# Altium schematic sheet POC_Power_Management.SchDoc
size A
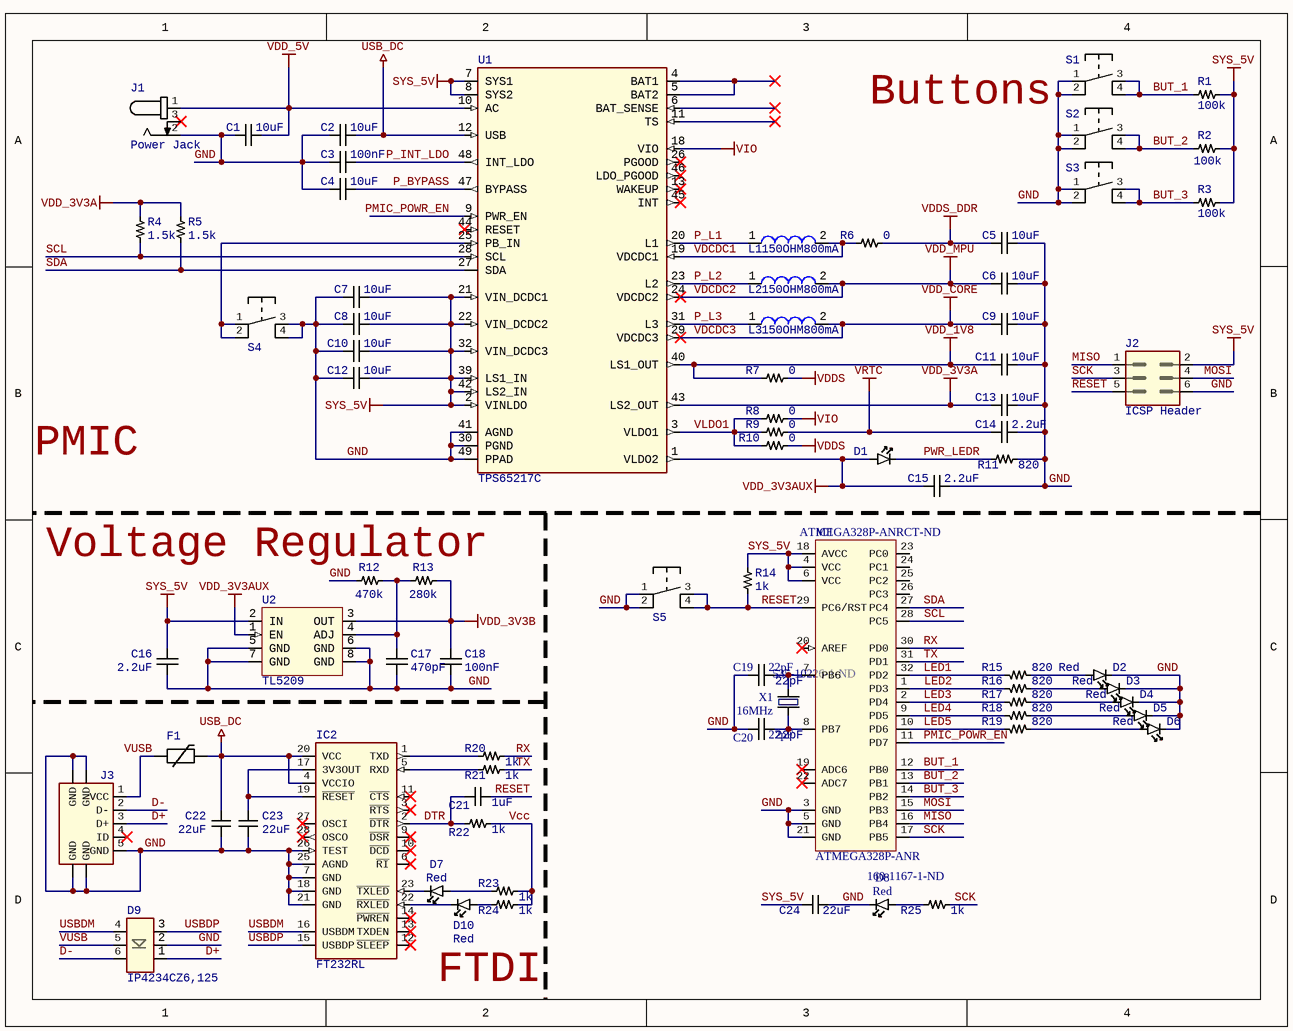
[diagram p0: POC_Power_Management.SchDoc]

## Parts
C1  Capacitance: 10uF  [CAP0805]  (hidden comment: C2012X6S1A106K085AC)
C2  Capacitance: 10uF  [CAP0805]  (hidden comment: C2012X6S1A106K085AC)
C3  Capacitance: 100nF  [CAP0402]  (hidden comment: C0402C104K4RACTU)
C4  Capacitance: 10uF  [CAP0805]  (hidden comment: C2012X6S1A106K085AC)
C5  Capacitance: 10uF  [CAP0805]  (hidden comment: C2012X6S1A106K085AC)
C6  Capacitance: 10uF  [CAP0805]  (hidden comment: C2012X6S1A106K085AC)
C7  Capacitance: 10uF  [CAP0805]  (hidden comment: C2012X6S1A106K085AC)
C8  Capacitance: 10uF  [CAP0805]  (hidden comment: C2012X6S1A106K085AC)
C9  Capacitance: 10uF  [CAP0805]  (hidden comment: C2012X6S1A106K085AC)
C10  Capacitance: 10uF  [CAP0805]  (hidden comment: C2012X6S1A106K085AC)
C11  Capacitance: 10uF  [CAP0805]  (hidden comment: C2012X6S1A106K085AC)
C12  Capacitance: 10uF  [CAP0805]  (hidden comment: C2012X6S1A106K085AC)
C13  Capacitance: 10uF  [CAP0805]  (hidden comment: C2012X6S1A106K085AC)
C14  Capacitance: 2.2uF  [CAP0402]  (hidden comment: C1005X5R0J225K050BC)
C15  Capacitance: 2.2uF  [CAP0402]  (hidden comment: C1005X5R0J225K050BC)
C16  Capacitance: 2.2uF  [CAP0402]  (hidden comment: C1005X5R0J225K050BC)
C17  Capacitance: 470pF  [CAP0402]  (hidden comment: GRM155R71H471KA01D)
C18  Capacitance: 100nF  [CAP0402]  (hidden comment: C0402C104K4RACTU)
C19  22pF  [CAP0402]
C20  22pF  [CAP0402]
C21  Capacitance: 1uF  [CAP0402]  (hidden comment: CC0402KRX5R5BB105)
C22  Capacitance: 22uF  [CAP0805]  (hidden comment: CL21A226MQQNNNE)
C23  Capacitance: 22uF  [CAP0805]  (hidden comment: CL21A226MQQNNNE)
C24  Capacitance: 22uF  [CAP0805]  (hidden comment: CL21A226MQQNNNE)
D1  Red  [LED]  (value not drawn)
D2  Red  [LED]
D3  Red  [LED]
D4  Red  [LED]
D5  Red  [LED]
D6  Red  [LED]
D7  Red  [LED]
D8  Red  Supplier Part Number 1: 160-1167-1-ND  [LED]
D9  IP4234CZ6,125  [TSOP-6]
D10  Red  [LED]
F1  MF-MSMF050-2  [FUSE]  (value not drawn)
IC1  ATMEGA328P-ANR  Supplier Part Number 1: ATMEGA328P-ANRCT-ND  [TQFP-32]
IC2  FT232RL  [SSOP-28]
J1  Power Jack  [Power_Jack]
J2  ICSP Header  [ICSP]
J3  XM7D-0512  [XM7D-0512]  (value not drawn)
L1  150OHM800mA  [FB0805]
L2  150OHM800mA  [FB0805]
L3  150OHM800mA  [FB0805]
R1  Resistance: 100k  [RES0402]  (hidden comment: RC0402FR-07100KL)
R2  Resistance: 100k  [RES0402]  (hidden comment: RC0402FR-07100KL)
R3  Resistance: 100k  [RES0402]  (hidden comment: RC0402FR-07100KL)
R4  Resistance: 1.5k  [RES0402]  (hidden comment: RC0402FR-071K5L)
R5  Resistance: 1.5k  [RES0402]  (hidden comment: RC0402FR-071K5L)
R6  Resistance: 0  [RES0402]  (hidden comment: RC0402JR-070RL)
R7  Resistance: 0  [RES0402]  (hidden comment: RC0402JR-070RL)
R8  Resistance: 0  [RES0402]  (hidden comment: RC0402JR-070RL)
R9  Resistance: 0  [RES0402]  (hidden comment: RC0402JR-070RL)
R10  Resistance: 0  [RES0402]  (hidden comment: RC0402JR-070RL)
R11  Resistance: 820  [RES0402]  (hidden comment: RC0402FR-07820RL)
R12  Resistance: 470k  [RES0402]  (hidden comment: RC0402FR-07470KL)
R13  Resistance: 280k  [RES0402]  (hidden comment: RC0402FR-07280KL)
R14  Resistance: 1k  [RES0402]  (hidden comment: RC0402FR-071KL)
R15  Resistance: 820  [RES0402]  (hidden comment: RC0402FR-07820RL)
R16  Resistance: 820  [RES0402]  (hidden comment: RC0402FR-07820RL)
R17  Resistance: 820  [RES0402]  (hidden comment: RC0402FR-07820RL)
R18  Resistance: 820  [RES0402]  (hidden comment: RC0402FR-07820RL)
R19  Resistance: 820  [RES0402]  (hidden comment: RC0402FR-07820RL)
R20  Resistance: 1k  [RES0402]  (hidden comment: RC0402FR-071KL)
R21  Resistance: 1k  [RES0402]  (hidden comment: RC0402FR-071KL)
R22  Resistance: 1k  [RES0402]  (hidden comment: RC0402FR-071KL)
R23  Resistance: 1k  [RES0402]  (hidden comment: RC0402FR-071KL)
R24  Resistance: 1k  [RES0402]  (hidden comment: RC0402FR-071KL)
R25  Resistance: 1k  [RES0402]  (hidden comment: RC0402FR-071KL)
S1  TL3305AF160QG  [Switch]  (value not drawn)
S2  TL3305AF160QG  [Switch]  (value not drawn)
S3  TL3305AF160QG  [Switch]  (value not drawn)
S4  TL3305AF160QG  [Switch]  (value not drawn)
S5  TL3305AF160QG  [Switch]  (value not drawn)
U1  TPS65217C  [PVQFN-48]
U2  TL5209  [SOIC-8]
X1  16MHz  Supplier Part Number 1: 535-10226-1-ND  [Crystal]

## Nets
SYS_5V: C7.1 C8.1 C10.1 C12.1 C16.1 C24.1 IC1.4(VCC) IC1.6(VCC) IC1.18(AVCC) J2.2 R1.1 R2.1 R3.1 R14.2 U1.2(VINLDO) U1.7(SYS1) U1.8(SYS2) U1.21(VIN_DCDC1) U1.22(VIN_DCDC2) U1.32(VIN_DCDC3) U1.39(LS1_IN) U1.42(LS2_IN) U2.2(IN)
USB_DC: C2.1 C22.1 F1.2 IC2.4(VCCIO) IC2.20(VCC) U1.12(USB)
VDCDC2: C6.2 L2.2 U1.24(VDCDC2)  [also labelled VDD_MPU]
VDCDC3: C9.2 L3.2 U1.29(VDCDC3)  [also labelled VDD_CORE]
VDD_1V8: C11.2 R7.1 U1.40(LS1_OUT)
VDD_3V3A: C13.2 R4.2 R5.2 U1.43(LS2_OUT)
VDD_3V3AUX: C15.2 D1.2 U1.1(VLDO2) U2.1(EN)
VDD_3V3B: C18.1 R13.2 U2.3(OUT)
VDD_5V: C1.1 J1.1 U1.10(AC)
VDDS: R7.2 R10.2
VDDS_DDR: C5.2 R6.2
VIO: R8.2 U1.18(VIO)
VRTC: C14.2 R9.2
BUT_1: IC1.12(PB0) R1.2 S1.3 S1.4
BUT_2: IC1.13(PB1) R2.2 S2.3 S2.4
BUT_3: IC1.14(PB2) R3.2 S3.3 S3.4
D+: D9.1 J3.3(D+)
D-: D9.6 J3.2(D-)
DTR: C21.1 IC2.2(~{DTR}) R22.1
GND: C1.2 C2.2 C3.2 C4.2 C5.1 C6.1 C7.2 C8.2 C9.1 C10.2 C11.1 C12.2 C13.1 C14.1 C15.1 C16.2 C17.2 C18.2 C19.2 C20.2 C22.2 C23.2 C24.2 D2.1 D3.1 D4.1 D5.1 D6.1 D8.1 D9.2 IC1.3(GND) IC1.5(GND) IC1.21(GND) IC2.7(GND) IC2.18(GND) IC2.21(GND) IC2.25(AGND) IC2.26(TEST) J1.2 J2.6 J3.5(GND) J3.SH1(GND) J3.SH2(GND) J3.SH3(GND) J3.SH4(GND) R11.2 R12.1 S1.1 S1.2 S2.1 S2.2 S3.1 S3.2 S4.3 S4.4 S5.1 S5.2 U1.30(PGND) U1.41(AGND) U1.49(PPAD) U2.5(GND) U2.6(GND) U2.7(GND) U2.8(GND)
LED1: IC1.32(PD2) R15.2
LED2: IC1.1(PD3) R16.2
LED3: IC1.2(PD4) R17.2
LED4: IC1.9(PD5) R18.2
LED5: IC1.10(PD6) R19.2
MISO: IC1.16(PB4) J2.1
MOSI: IC1.15(PB3) J2.4
P_BYPASS: C4.1 U1.47(BYPASS)
P_INT_LDO: C3.1 U1.48(INT_LDO)
P_L1: L1.1 U1.20(L1)
P_L2: L2.1 U1.23(L2)
P_L3: L3.1 U1.31(L3)
PMIC_POWR_EN: IC1.11(PD7) U1.9(PWR_EN)
PWR_LEDR: D1.1 R11.1
RESET: C21.2 IC1.29(PC6/RST) J2.5 R14.1 S5.3 S5.4
RX: IC1.30(PD0) R20.2
SCK: IC1.17(PB5) J2.3 R25.2
SCL: IC1.28(PC5) R4.1 U1.28(SCL)
SDA: IC1.27(PC4) R5.1 U1.27(SDA)
TX: IC1.31(PD1) R21.2
USBDM: D9.4 IC2.16(USBDM)
USBDP: D9.3 IC2.15(USBDP)
Vcc: R22.2 R23.2 R24.2
VDCDC1: L1.2 R6.1 U1.19(VDCDC1)
VLDO1: R8.1 R9.1 R10.1 U1.3(VLDO1)
VUSB: D9.5 F1.1 J3.1(VCC)
NetC17_1: C17.1 R12.2 R13.1 U2.4(ADJ)
NetC19_1: C19.1 IC1.7(PB6) X1.2
NetC20_1: C20.1 IC1.8(PB7) X1.1
NetC23_1: C23.1 IC2.17(3V3OUT) IC2.19(~{RESET})
NetD2_2: D2.2 R15.1
NetD3_2: D3.2 R16.1
NetD4_2: D4.2 R17.1
NetD5_2: D5.2 R18.1
NetD6_2: D6.2 R19.1
NetD7_1: D7.1 IC2.23(~{TXLED})
NetD7_2: D7.2 R23.1
NetD8_2: D8.2 R25.1
NetD10_1: D10.1 IC2.22(~{RXLED})
NetD10_2: D10.2 R24.1
NetIC2_1: IC2.1(TXD) R20.1
NetIC2_5: IC2.5(RXD) R21.1
NetS4_1: S4.1 S4.2 U1.25(PB_IN)
NetU1_4: U1.4(BAT1) U1.5(BAT2)

Not connected (* = marked no-connect by the designer): IC1 19(ADC6)* 20(AREF)* 22(ADC7)* 23(PC0) 24(PC1) 25(PC2) 26(PC3); IC2 3(~{RTS})* 6(~{RI})* 9(~{DSR})* 10(~{DCD})* 11(~{CTS})* 12(~{SLEEP})* 13(TXDEN)* 14(~{PWREN})* 27(OSCI)* 28(OSCO)*; J1 3*; J3 4(ID)*; U1 6(BAT_SENSE)* 11(TS)* 13(WAKEUP)* 26(PGOOD)* 44(RESET)* 45(INT)* 46(LDO_PGOOD)*

## Notes on the sheet
- Buttons
- PMIC
- Voltage Regulator
- FTDI

## Library data of the parts
C1 C2 C4-C13 = CAP_10uF: MLCC 10uF 0805 SMD; Manufacturer: TDK; Dielectric Material: Ceramic; Tolerance: 10%; Voltage Rating: 10V; Dielectric: X6S; Supplier 1: Digi-Key; Manufacturer Part Number: C2012X6S1A106K085AC; Stock 1: 46852; Pricing 1: 1=0.30000, 10=0.20500, 100=0.11610, 500=0.08198, 1000=0.07173 (USD); RoHS: Yes; Mount: Surface Mount; Case/Package: 0805; Weight: 0.000194oz; Case Code (Metric): 2012; Case Code (Imperial): 0805; Min Operating Temperature: -55°C; Max Operating Temperature: 105°C; Packaging: Tape and Reel; Termination: SMD/SMT; Package Quantity: 4000; Voltage Rating (DC): 10V; Composition: Ceramic; Length: 2mm; Height: 1.25mm; Depth: 1.25mm; Width: 0.049inch; Thickness: 0.037inch; REACH SVHC: No SVHC; Lead Free: Lead Free; ComponentLink3URL: https://datasheet.ciiva.com/6290/tdkmlcccaprange-6290501.pdf?src-supplier=Digi-Key; ComponentLink3Description: Datasheet; Supplier Part Number 1: 445-7613-1-ND
C3 C18 = CAP_100nF: MLCC 100nF 0402 SMD; Manufacturer: KEMET; Tolerance: 10%; Voltage Rating (DC): 16V; Dielectric: X7R; Dissipation Factor: 3.5%; Supplier 1: Digi-Key; Manufacturer Part Number: C0402C104K4RACTU; Stock 1: 6512243; Pricing 1: 1=0.10000, 10=0.04200, 100=0.01860, 500=0.01328, 1000=0.01044, 2500=0.00949, 5000=0.00873 (USD); RoHS: Yes; Mount: Surface Mount; Case/Package: 0402; Case Code (Imperial): 0402; Case Code (Metric): 1005; Contact Plating: Tin,Matte; Min Operating Temperature: -55°C; Max Operating Temperature: 125°C; Packaging: Tape and Reel; Package Quantity: 10000; Voltage Rating: 16V; Termination: SMD/SMT; Length: 1mm; Height: 0.5mm; Width: 0.5mm; Depth: 0.5mm; Radiation Hardening: No; ComponentLink2URL: https://datasheet.ciiva.com/18192/getdatasheetpartid-385384-18192412.pdf?src-supplier=Verical; ComponentLink2Description: Datasheet; Supplier Part Number 1: 399-3521-1-ND
C14-C16 = CAP_2.2uF: MLCC 2.2uF 0402 SMD; Manufacturer: TDK; Dielectric Material: Ceramic; Tolerance: 10%; Dielectric: X5R; Voltage Rating: 6.3V; Supplier 1: Digi-Key; Manufacturer Part Number: C1005X5R0J225K050BC; RoHS: Yes; Mount: Surface Mount; Case/Package: 0402; Number of Pins: 2; Weight: 2.3E-05oz; Case Code (Metric): 1005; Case Code (Imperial): 0402; Min Operating Temperature: -55°C; Max Operating Temperature: 85°C; Packaging: Tape and Reel; Voltage Rating (DC): 6.3V; Termination: SMD/SMT; Package Quantity: 1; Composition: Ceramic; Voltage: 6.3V; Length: 1mm; Height: 0.5mm; Width: 0.02inch; Depth: 0.5mm; Thickness: 0.022inch; Radiation Hardening: No; Lead Free: Lead Free; REACH SVHC: No SVHC; ComponentLink7Description: Datasheet; ComponentLink7URL: https://product.tdk.com/info/en/catalog/datasheets/mlcc_commercial_general_en.pdf?ref_disty=digikey; Supplier Part Number 1: 445-6847-1-ND
C17 = CAP_470pF: MLCC 470pF 0402 SMD; Manufacturer: Murata; Material: Ceramic; Tolerance: 10%; Dielectric: X7R; Voltage Rating: 50V; Supplier 1: Digi-Key; Manufacturer Part Number: GRM155R71H471KA01D; Stock 1: 1824670; Pricing 1: 1=0.10000, 10=0.04900, 100=0.02200, 500=0.01572, 1000=0.01235, 2500=0.01122, 5000=0.01033 (USD); RoHS: Yes; Mount: Surface Mount; Case/Package: 0402; Number of Pins: 2; Case Code (Metric): 1005; Case Code (Imperial): 0402; Min Operating Temperature: -55°C; Max Operating Temperature: 125°C; Package Quantity: 1; Packaging: Tape and Reel; Voltage Rating (DC): 50V; Termination: SMD/SMT; Voltage: 50V; Length: 1mm; Height: 0.5mm; Width: 0.02inch; Thickness: 0.022inch; Depth: 0.5mm; Radiation Hardening: No; REACH SVHC: No SVHC; Lead Free: Lead Free; ComponentLink1URL: https://datasheet.ciiva.com/11786/0900766b80ef921d-11786912.pdf?src-supplier=RSComponents; ComponentLink1Description: https://datasheet.ciiva.com/11786/0900766b80ef921d-11786912.pdf?src-supplier=RSComponents; ComponentLink2URL: https://datasheet.ciiva.com/18101/getdatasheetpartid-37722-18101030.pdf?src-supplier=Verical; ComponentLink2Description: https://datasheet.ciiva.com/18101/getdatasheetpartid-37722-18101030.pdf?src-supplier=Verical; ComponentLink3URL: https://datasheet.ciiva.com/19476/1856505-19476137.pdf?src-supplier=Jameco; ComponentLink3Description: https://datasheet.ciiva.com/19476/1856505-19476137.pdf?src-supplier=Jameco; ComponentLink4URL: https://datasheet.ciiva.com/29199/454340-da-01-en-vs-kondensator-0402-29199656.pdf?src-supplier=Conrad; ComponentLink4Description: https://datasheet.ciiva.com/29199/454340-da-01-en-vs-kondensator-0402-29199656.pdf?src-supplier=Conrad; ComponentLink5URL: https://datasheet.ciiva.com/129/partnumbering-e-01-129843.pdf?src-supplier=Digi-Key; ComponentLink5Description: https://datasheet.ciiva.com/129/partnumbering-e-01-129843.pdf?src-supplier=Digi-Key; ComponentLink6URL: https://datasheet.ciiva.com/129/partnumbering-e-01-129844.pdf?src-supplier=Digi-Key; ComponentLink6Description: https://datasheet.ciiva.com/129/partnumbering-e-01-129844.pdf?src-supplier=Digi-Key; ComponentLink7URL: https://datasheet.ciiva.com/129/partnumbering-e-01-129845.pdf?src-supplier=Digi-Key; ComponentLink7Description: https://datasheet.ciiva.com/129/partnumbering-e-01-129845.pdf?src-supplier=Digi-Key; ComponentLink8URL: https://datasheet.ciiva.com/14116/grmseries-highdielectrictype-eng-14116837.pdf?src-supplier=Distrelec; ComponentLink8Description: https://datasheet.ciiva.com/14116/grmseries-highdielectrictype-eng-14116837.pdf?src-supplier=Distrelec; ComponentLink9URL: https://datasheet.ciiva.com/22698/608985-22698425.pdf?src-supplier=Element14; ComponentLink9Description: https://datasheet.ciiva.com/22698/608985-22698425.pdf?src-supplier=Element14; ComponentLink10URL: https://datasheet.ciiva.com/16199/product-16199180.pdf?src-supplier=Future+Electronics; ComponentLink10Description: https://datasheet.ciiva.com/16199/product-16199180.pdf?src-supplier=Future+Electronics; ComponentLink11URL: https://datasheet.ciiva.com/7937/608985-7937630.pdf?src-supplier=Element14; ComponentLink11Description: https://datasheet.ciiva.com/7937/608985-7937630.pdf?src-supplier=Element14; Supplier Part Number 1: 490-1300-1-ND
C19 C20 = CAP_22pF: MLCC 22pF 0402 SMD; Manufacturer: Yageo; Manufacturer Part Number: CC0402JRNPO9BN220; Dielectric Material: Ceramic; Tolerance: 5%; Dielectric: C0G; Voltage Rating (DC): 50V; Temperature Coefficient: 30ppm/°C; Insulation Resistance: 100GR; Supplier 1: Digi-Key; Stock 1: 3577721; Pricing 1: 1=0.10000, 10=0.02200, 100=0.00970, 500=0.00694, 1000=0.00545, 2500=0.00495, 5000=0.00455 (USD); RoHS: Yes; Mount: Surface Mount; Case/Package: 0402; Number of Pins: 2; Case Code (Metric): 1005; Case Code (Imperial): 0402; Min Operating Temperature: -55°C; Max Operating Temperature: 125°C; Voltage: 50V; Voltage Rating: 50V; Packaging: Tape and Reel; Package Quantity: 1; Termination: SMD/SMT; Composition: Ceramic; Length: 1mm; Height: 0.5mm; Depth: 0.5mm; Width: 0.02inch; Thickness: 0.022inch; Radiation Hardening: No; REACH SVHC: No SVHC; Lead Free: Lead Free; ComponentLink1URL: https://datasheet.ciiva.com/143/mlccorderingcode-143986.pdf?src-supplier=Digi-Key; ComponentLink1Description: https://datasheet.ciiva.com/143/mlccorderingcode-143986.pdf?src-supplier=Digi-Key; ComponentLink2URL: https://datasheet.ciiva.com/143/mlccorderingcode-143987.pdf?src-supplier=Digi-Key; ComponentLink2Description: https://datasheet.ciiva.com/143/mlccorderingcode-143987.pdf?src-supplier=Digi-Key; ComponentLink3URL: https://datasheet.ciiva.com/143/mlccorderingcode-143988.pdf?src-supplier=Digi-Key; ComponentLink3Description: https://datasheet.ciiva.com/143/mlccorderingcode-143988.pdf?src-supplier=Digi-Key; ComponentLink4URL: https://datasheet.ciiva.com/5789/1443161-5789509.pdf?src-supplier=Farnell; ComponentLink4Description: https://datasheet.ciiva.com/5789/1443161-5789509.pdf?src-supplier=Farnell; ComponentLink5URL: https://datasheet.ciiva.com/8033/1443161-8033605.pdf?src-supplier=Element14; ComponentLink5Description: https://datasheet.ciiva.com/8033/1443161-8033605.pdf?src-supplier=Element14; ComponentLink6URL: https://datasheet.ciiva.com/16625/upy-gp-np0-16v-to-50v-8-16625509.pdf?src-supplier=Avnet+Europe; ComponentLink6Description: https://datasheet.ciiva.com/16625/upy-gp-np0-16v-to-50v-8-16625509.pdf?src-supplier=Avnet+Europe; ComponentLink7URL: https://datasheet.ciiva.com/8033/1443161-8033606.pdf?src-supplier=Element14; ComponentLink7Description: https://datasheet.ciiva.com/8033/1443161-8033606.pdf?src-supplier=Element14; ComponentLink8URL: https://datasheet.ciiva.com/7656/1132289-7656615.pdf?src-supplier=Element14; ComponentLink8Description: https://datasheet.ciiva.com/7656/1132289-7656615.pdf?src-supplier=Element14; ComponentLink9URL: https://datasheet.ciiva.com/8033/1443161-8033607.pdf?src-supplier=Element14; ComponentLink9Description: https://datasheet.ciiva.com/8033/1443161-8033607.pdf?src-supplier=Element14; ComponentLink10URL: https://datasheet.ciiva.com/5425/upy-gp-np0-16v-to-50v-8-5425483.pdf?src-supplier=Mouser; ComponentLink10Description: https://datasheet.ciiva.com/5425/upy-gp-np0-16v-to-50v-8-5425483.pdf?src-supplier=Mouser; ComponentLink11URL: https://datasheet.ciiva.com/15189/getdatasheetpartid-370074-15189117.pdf?src-supplier=Verical; ComponentLink11Description: https://datasheet.ciiva.com/15189/getdatasheetpartid-370074-15189117.pdf?src-supplier=Verical; Supplier Part Number 1: 311-1018-1-ND; Capacitance: 22pF
C21 = CAP_1uF: MLCC 1uF 0402 SMD; Manufacturer: Yageo; Value: CAP CER 1UF 16V X7R 1206; Dielectric Material: Ceramic; Tolerance: 10%; Dielectric: X5R; Voltage Rating: 6.3V; Digikey Link: https://www.digikey.com/product-detail/en/C1206C105M4RACTU/399-8150-1-ND/3471873/?itemSeq=304982366; Digikey Part: 399-8150-1-ND; Supplier 1: Digi-Key; Manufacturer Part Number: CC0402KRX5R5BB105; Stock 1: 41021902; Pricing 1: 1=0.10000, 10=0.04700, 100=0.02100, 500=0.01502, 1000=0.01180, 2500=0.01072, 5000=0.00987 (USD); RoHS: Yes; Mount: Surface Mount; Case/Package: 0402; Number of Pins: 2; Case Code (Metric): 1005; Case Code (Imperial): 0402; Min Operating Temperature: -55°C; Max Operating Temperature: 85°C; Voltage Rating (DC): 6.3V; Package Quantity: 1; Packaging: Tape and Reel; Termination: SMD/SMT; Composition: Ceramic; Length: 1mm; Height: 0.5mm; Width: 0.02inch; Thickness: 0.022inch; Depth: 0.5mm; Radiation Hardening: No; REACH SVHC: No SVHC; Lead Free: Lead Free; Halogen Free: Halogen Free; ComponentLink1URL: https://datasheet.ciiva.com/5789/70765-5789520.pdf?src-supplier=Farnell; ComponentLink1Description: https://datasheet.ciiva.com/5789/70765-5789520.pdf?src-supplier=Farnell; ComponentLink2URL: https://datasheet.ciiva.com/176/mlccorderingcode-176609.pdf?src-supplier=Digi-Key; ComponentLink2Description: https://datasheet.ciiva.com/176/mlccorderingcode-176609.pdf?src-supplier=Digi-Key; ComponentLink3URL: https://datasheet.ciiva.com/16624/upy-gphc-x5r-4v-to-50v-12-16624731.pdf?src-supplier=Avnet+Europe; ComponentLink3Description: https://datasheet.ciiva.com/16624/upy-gphc-x5r-4v-to-50v-12-16624731.pdf?src-supplier=Avnet+Europe; ComponentLink4URL: https://datasheet.ciiva.com/8033/1525783-8033644.pdf?src-supplier=Element14; ComponentLink4Description: https://datasheet.ciiva.com/8033/1525783-8033644.pdf?src-supplier=Element14; ComponentLink5URL: https://datasheet.ciiva.com/176/mlccorderingcode-176610.pdf?src-supplier=Digi-Key; ComponentLink5Description: https://datasheet.ciiva.com/176/mlccorderingcode-176610.pdf?src-supplier=Digi-Key; ComponentLink6URL: https://datasheet.ciiva.com/176/mlccorderingcode-176611.pdf?src-supplier=Digi-Key; ComponentLink6Description: https://datasheet.ciiva.com/176/mlccorderingcode-176611.pdf?src-supplier=Digi-Key; ComponentLink7URL: https://datasheet.ciiva.com/8033/1525783-8033643.pdf?src-supplier=Element14; ComponentLink7Description: https://datasheet.ciiva.com/8033/1525783-8033643.pdf?src-supplier=Element14; ComponentLink8URL: https://datasheet.ciiva.com/28450/1359354-28450285.pdf?src-supplier=Element14; ComponentLink8Description: https://datasheet.ciiva.com/28450/1359354-28450285.pdf?src-supplier=Element14; ComponentLink9URL: https://datasheet.ciiva.com/8033/70765-8033646.pdf?src-supplier=Element14; ComponentLink9Description: https://datasheet.ciiva.com/8033/70765-8033646.pdf?src-supplier=Element14; ComponentLink10URL: https://datasheet.ciiva.com/11464/upy-gphc-x5r-4v-to-50v-12-11464863.pdf?src-supplier=Avnet; ComponentLink10Description: https://datasheet.ciiva.com/11464/upy-gphc-x5r-4v-to-50v-12-11464863.pdf?src-supplier=Avnet; Supplier Part Number 1: 311-1438-1-ND
C22-C24 = CAP_22uF: MLCC 22uF 0805 SMD; Manufacturer: Samsung; Value: CAP CER 22UF 16V X5R 1206; Tolerance: 20%; Dielectric: X5R; Voltage Rating (DC): 6.3V; Digikey Link: https://www.digikey.com/product-detail/en/CL31A226MOCLNNC/1276-2728-1-ND/3890814/?itemSeq=304982363; Digikey Part: 1276-2728-1-ND; Supplier 1: Digi-Key; Manufacturer Part Number: CL21A226MQQNNNE; Stock 1: 4275367; Pricing 1: 1=0.18000, 10=0.12100, 100=0.06140, 500=0.04204, 1000=0.03719 (USD); RoHS: Yes; Mount: Surface Mount; Case/Package: 0805; Case Code (Metric): 2012; Case Code (Imperial): 0805; Contact Plating: Tin; Min Operating Temperature: -55°C; Max Operating Temperature: 85°C; Package Quantity: 2000; Packaging: Tape and Reel; Voltage Rating: 6.3V; Length: 2mm; Height: 1.25mm; Width: 0.049inch; Thickness: 0.055inch; Depth: 1.25mm; Radiation Hardening: No; Lead Free: Lead Free; ComponentLink1URL: https://datasheet.ciiva.com/25796/cl21a226mqqnnne-25796195.pdf?src-supplier=Digi-Key; ComponentLink1Description: https://datasheet.ciiva.com/25796/cl21a226mqqnnne-25796195.pdf?src-supplier=Digi-Key; ComponentLink2URL: https://datasheet.ciiva.com/26838/getdatasheetpartid-357607-26838611.pdf?src-supplier=Verical; ComponentLink2Description: https://datasheet.ciiva.com/26838/getdatasheetpartid-357607-26838611.pdf?src-supplier=Verical; ComponentLink3URL: https://datasheet.ciiva.com/16361/cl21a226mqqnnne-16361189.pdf?src-supplier=Future+Electronics; ComponentLink3Description: https://datasheet.ciiva.com/16361/cl21a226mqqnnne-16361189.pdf?src-supplier=Future+Electronics; ComponentLink4URL: https://datasheet.ciiva.com/26787/cl21a226mqqnnne-26787006.pdf?src-supplier=IIIC; ComponentLink4Description: https://datasheet.ciiva.com/26787/cl21a226mqqnnne-26787006.pdf?src-supplier=IIIC; Supplier Part Number 1: 1276-1100-1-ND
D1-D8 D10 = LED_Red: Red 638nm LED Indication - Discrete 1.8V 1206 (3216 Metric); Value: LED RED CLEAR 1206 SMD; Digikey Link: https://www.digikey.com/product-detail/en/LTST-C150CKT/160-1167-1-ND/269239/?itemSeq=304982368; Digikey Part: 160-1167-1-ND; Supplier 1: Digi-Key
  D1-D7 D10: Supplier Part Number 1: 160-1167-1-ND
D9 = TVS_Diode: Clamp Ipp Tvs Diode Surface Mount 6-TSOP; Value: TVS DIODE 5.5V 6TSOP; Digikey Part: 1727-4717-1-ND; Digikey Link: https://www.digikey.com/product-detail/en/IP4234CZ6%2c125/1727-4717-1-ND/2531156/?itemSeq=304982369; Supplier 1: Digi-Key; Supplier Part Number 1: 1727-4717-1-ND
F1 = Fuse: Polymeric PTC Resettable Fuse 15V 500mA Ih Surface Mount 1812 (4532 Metric), Concave; Value: PTC RESET FUSE 15V 500MA 1812; Digikey Link: https://www.digikey.com/product-detail/en/MF-MSMF050-2/MF-MSMF050-2CT-ND/662842/?itemSeq=304982360; Digikey Part: MF-MSMF050-2CT-ND; Supplier 1: Digi-Key; Supplier Part Number 1: MF-MSMF050-2CT-ND
IC1 = ATMega328P: AVR AVR® ATmega Microcontroller IC 8-Bit 20MHz 32KB (16K x 16) FLASH 32-TQFP (7x7); Value: IC MCU 8BIT 32KB FLASH 32TQFP; Digikey Link: https://www.digikey.com/product-detail/en/ATMEGA328P-ANR/ATMEGA328P-ANRCT-ND/2774230/?itemSeq=304982365; Digikey Part: ATMEGA328P-ANRCT-ND; Supplier 1: Digi-Key
IC2 = IC_FT232RL: USB Bridge, USB to UART USB 2.0 UART Interface 28-SSOP; Value: IC USB FS SERIAL UART 28-SSOP; Digikey Part: 768-1007-1-ND; Digikey Link: https://www.digikey.com/product-detail/en/FT232RL-REEL/768-1007-1-ND/1836402/?itemSeq=304982359; Supplier 1: Digi-Key; Supplier Part Number 1: 768-1007-1-ND
J1 = Power Jack: Power Barrel Connector Jack 2.10mm ID (0.083"), 5.50mm OD (0.217") Through Hole, Right Angle; Value: CONN PWR JACK 2X5.5MM SOLDER; Digikey Link: https://www.digikey.com/product-detail/en/PJ-102A/CP-102A-ND/275425/?itemSeq=304982367; Digikey Part: CP-102A-ND; Supplier 1: Digi-Key; Supplier Part Number 1: CP-102A-ND
J2 = HDR_ICSP: 2x3 Header for Arduino ICSP; Supplier 1: Digi-Key; Supplier Part Number 1: S2012EC-03-ND
J3 = USB: USB - mini B USB 2.0 Receptacle Connector 5 Position Through Hole, Right Angle; Value: CONN RCPT USB2.0 MINI B 5P R/A; Digikey Link: https://www.digikey.com/product-detail/en/XM7D-0512/OR1205-ND/4695531/?itemSeq=304982356; Digikey Part: OR1205-ND; Supplier 1: Digi-Key; Supplier Part Number 1: OR1205-ND
L1-L3 = IND: FERRITE 800MA 150 OHM 0805 SMD; Manufacturer: Laird-Signal Integrity Products; Manufacturer Part Number: LI0805H151R-10; DC Resistance (DCR): 150 mOhm Max; Impedance @ Frequency: 150 Ohm @ 100MHz; Filter Type: Differential Mode - Single; Supplier 1: Digi-Key; Supplier Part Number 1: 240-2384-6-ND; RoHS: RoHS Compliant; Category: Filters; Stock 1: 10144; Pricing 1: 1=0.1, 10=0.07, 25=0.064, 50=0.0574, 100=0.0421, 250=0.03064, 500=0.02808, 1000=0.02424 (USD); Current Rating: 800mA; Package / Case: 0805 (2012 Metric); Size / Dimension: 0.079" L x 0.049" W (2.00mm x 1.25mm); Mounting Type: Surface Mount; Packaging: Digi-Reel®; ComponentLink1URL: http://www.lairdtech.com/WorkArea/linkit.aspx?LinkIdentifier=id&ItemID=4912; ComponentLink1Description: http://www.lairdtech.com/WorkArea/linkit.aspx?LinkIdentifier=id&ItemID=4912; Height (Max): 0.043" (1.10mm)
R1-R3 = RES_100k: Resistor 100kOhm 0402 SMD; Manufacturer: Yageo; Tolerance: 1%; Temperature Coefficient: 100ppm/°C; Power Rating: 63mW; Voltage Rating: 50V; Manufacturer Part Number: RC0402FR-07100KL; RoHS: Yes; Case/Package: 0402; Case Code (Metric): 1005; Case Code (Imperial): 0402; Min Operating Temperature: -55°C; Max Operating Temperature: 155°C; Composition: Thick Film; Packaging: Tape and Reel; Package Quantity: 1; Number of Terminations: 2; Termination: SMD/SMT; Military Standard: Not; Max Power Dissipation: 63mW; Working Voltage: 50V; Features: Moisture Resistant; Length: 0.039inch; Height: 0.016inch; Width: 0.02inch; Depth: 0.5mm; REACH SVHC: No SVHC; Lead Free: Lead Free; ComponentLink2Description: Datasheet; ComponentLink2URL: https://www.yageo.com/upload/media/product/productsearch/datasheet/rchip/PYu-RC_Group_51_RoHS_L_10.pdf; Supplier 1: Digi-Key; Supplier Part Number 1: 311-100KLRCT-ND
R4 R5 = RES_1.5k: Resistor 1.5kOhm 0402 SMD; Manufacturer: Yageo; Power Rating: 62.5mW; Tolerance: 1%; Voltage Rating: 50V; Temperature Coefficient: 100ppm/°C; Max Power Dissipation: 63mW; Manufacturer Part Number: RC0402FR-071K5L; RoHS: Yes; Case/Package: 0402; Case Code (Metric): 1005; Case Code (Imperial): 0402; Min Operating Temperature: -55°C; Max Operating Temperature: 155°C; Composition: Thick Film; Package Quantity: 1; Packaging: Tape and Reel; Number of Terminations: 2; Termination: SMD/SMT; Military Standard: Not; Features: Moisture Resistant; Length: 1mm; Height: 0.016inch; Width: 0.02inch; Depth: 0.5mm; REACH SVHC: No SVHC; Lead Free: Lead Free; Supplier 1: Digi-Key; Supplier Part Number 1: 311-1.50KLRCT-ND; ComponentLink1Description: Datasheet; ComponentLink1URL: https://www.yageo.com/upload/media/product/productsearch/datasheet/rchip/PYu-RC_Group_51_RoHS_L_10.pdf
R6-R10 = RES_0: Resistor 0Ohm 0402 SMD; Manufacturer: Yageo; Power Rating: 62.5mW; Tolerance: 5%; Voltage Rating: 50V; Temperature Coefficient: 200ppm/°C; Max Power Dissipation: 63mW; Supplier 1: Digi-Key; Manufacturer Part Number: RC0402JR-070RL; Stock 1: 68160806; Pricing 1: 1=0.10000, 10=0.01300, 25=0.00920, 50=0.00700, 100=0.00510, 250=0.00392, 500=0.00312, 1000=0.00230, 5000=0.00165 (USD); RoHS: Yes; Case/Package: 0402; Contact Plating: Tin,Matte; Case Code (Metric): 1005; Case Code (Imperial): 0402; Min Operating Temperature: -55°C; Max Operating Temperature: 155°C; Composition: Thick Film; Packaging: Tape and Reel; Termination: SMD/SMT; Package Quantity: 1; Number of Terminations: 2; Military Standard: Not; Features: Moisture Resistant; Length: 1mm; Height: 0.016inch; Width: 0.02inch; Depth: 0.5mm; Radiation Hardening: No; Lead Free: Lead Free; REACH SVHC: Unknown; Supplier Part Number 1: 311-0.0JRCT-ND; ComponentLink1Description: Digikey; ComponentLink1URL: https://www.digikey.com/product-detail/en/yageo/RC0402JR-070RL/311-0.0JRCT-ND/729353; ComponentLink2Description: Datasheet; ComponentLink2URL: https://www.yageo.com/upload/media/product/productsearch/datasheet/rchip/PYu-RC_Group_51_RoHS_L_10.pdf
R11 R15-R19 = RES_820: Resistor 820Ohm 0402 SMD; Manufacturer: Yageo; Voltage Rating: 50V; Tolerance: 1%; Power Rating: 63mW; Temperature Coefficient: 100ppm/°C; Supplier 1: Digi-Key; Manufacturer Part Number: RC0402FR-07820RL; Stock 1: 1640857; Pricing 1: 1=0.10000, 10=0.01600, 100=0.00640, 1000=0.00289, 2500=0.00251, 5000=0.00207 (USD); RoHS: Yes; Case/Package: 0402; Case Code (Imperial): 0402; Case Code (Metric): 1005; Min Operating Temperature: -55°C; Max Operating Temperature: 155°C; Packaging: Tape and Reel; Package Quantity: 1; Termination: SMD/SMT; Composition: Thick Film; Number of Terminations: 2; Military Standard: Not; Max Power Dissipation: 63mW; Features: Moisture Resistant; Length: 1mm; Height: 0.016inch; Width: 0.5mm; Depth: 0.5mm; REACH SVHC: Unknown; Lead Free: Lead Free; Supplier Part Number 1: 311-820LRCT-ND
R12 = RES_470k: Resistor 470kOhm 0402 SMD; Manufacturer: Yageo; Tolerance: 1%; Power Rating: 62.5mW; Voltage Rating: 50V; Temperature Coefficient: 100ppm/°C; Max Power Dissipation: 63mW; Supplier 1: Digi-Key; Manufacturer Part Number: RC0402FR-07470KL; Stock 1: 2249859; Pricing 1: 1=0.10000, 10=0.01600, 100=0.00640, 1000=0.00289, 2500=0.00251, 5000=0.00207 (USD); RoHS: Yes; Case/Package: 0402; Number of Pins: 2; Case Code (Imperial): 0402; Case Code (Metric): 1005; Min Operating Temperature: -55°C; Max Operating Temperature: 155°C; Packaging: Tape and Reel; Voltage Rating (DC): 50V; Package Quantity: 1; Termination: SMD/SMT; Composition: Thick Film; Number of Terminations: 2; Military Standard: Not; Features: Moisture Resistant; Length: 1mm; Height: 0.016inch; Width: 0.02inch; Depth: 0.5mm; REACH SVHC: No SVHC; Lead Free: Lead Free; Supplier Part Number 1: 311-470KLRCT-ND; ComponentLink1Description: Datasheet; ComponentLink1URL: https://www.yageo.com/upload/media/product/productsearch/datasheet/rchip/PYu-RC_Group_51_RoHS_L_10.pdf
R13 = RES_280k: Resistor 280kOhm 0402 SMD; Manufacturer: Yageo; Tolerance: 1%; Temperature Coefficient: 100ppm/°C; Power Rating: 62.5mW; Voltage Rating: 50V; Max Power Dissipation: 63mW; Supplier 1: Digi-Key; ComponentLink1Description: Datasheet; ComponentLink1URL: https://www.yageo.com/upload/media/product/productsearch/datasheet/rchip/PYu-RC_Group_51_RoHS_L_10.pdf; Supplier Part Number 1: YAG3087CT-ND; Manufacturer Part Number: RC0402FR-07280KL; Stock 1: 1301983; Pricing 1: 1=0.10000, 10=0.01600, 100=0.00640, 1000=0.00289, 2500=0.00251, 5000=0.00207 (USD); RoHS: Yes; Case/Package: 0402; Contact Plating: Tin,Matte,Lead; Case Code (Imperial): 0402; Case Code (Metric): 1005; Min Operating Temperature: -55°C; Max Operating Temperature: 155°C; Composition: Thick Film; Packaging: Tape and Reel; Termination: SMD/SMT; Number of Terminations: 2; Military Standard: Not; Voltage Rating (DC): 50V; Features: Moisture Resistant; Length: 1mm; Height: 0.016inch; Width: 0.5mm; Depth: 0.5mm; Radiation Hardening: No; Lead Free: Lead Free
R14 R20-R25 = RES_1k: Resistor 1kOhm 0402 SMD; Manufacturer: Yageo; Value: RES 1K OHM 1% 1/2W 1206; Tolerance: 1%; Temperature Coefficient: 100ppm/°C; Voltage Rating (DC): 50V; Power Rating: 62.5mW; Digikey Link: https://www.digikey.com/product-detail/en/RNCP1206FTD1K00/RNCP1206FTD1K00CT-ND/2240675/?itemSeq=304982373; Digikey Part: RNCP1206FTD1K00CT-ND; Supplier 1: Digi-Key; Manufacturer Part Number: RC0402FR-071KL; Stock 1: 57749807; Pricing 1: 1=0.10000, 10=0.01600, 100=0.00640, 1000=0.00289, 2500=0.00251, 5000=0.00207 (USD); RoHS: Yes; Case/Package: 0402; Number of Pins: 2; Case Code (Imperial): 0402; Case Code (Metric): 1005; Min Operating Temperature: -55°C; Max Operating Temperature: 155°C; Composition: Thick Film; Packaging: Tape and Reel; Voltage Rating: 50V; Termination: SMD/SMT; Military Standard: Not; Length: 1mm; Height: 0.32mm; Width: 0.5mm; Depth: 0.5mm; REACH SVHC: Unknown; Lead Free: Lead Free; ComponentLink1URL: https://datasheet.ciiva.com/11819/0900766b80c66297-11819477.pdf?src-supplier=RSComponents; ComponentLink1Description: https://datasheet.ciiva.com/11819/0900766b80c66297-11819477.pdf?src-supplier=RSComponents; ComponentLink2URL: https://datasheet.ciiva.com/12666/pyu-rc0402-51-rohs-l-6-r-12666741.pdf?src-supplier=Mouser; ComponentLink2Description: https://datasheet.ciiva.com/12666/pyu-rc0402-51-rohs-l-6-r-12666741.pdf?src-supplier=Mouser; ComponentLink3URL: https://datasheet.ciiva.com/17063/pyu-rc0402-51-rohs-l-6-r-17063193.pdf?src-supplier=Future+Electronics; ComponentLink3Description: https://datasheet.ciiva.com/17063/pyu-rc0402-51-rohs-l-6-r-17063193.pdf?src-supplier=Future+Electronics; ComponentLink4URL: https://datasheet.ciiva.com/22747/1018594-22747513.pdf?src-supplier=Element14; ComponentLink4Description: https://datasheet.ciiva.com/22747/1018594-22747513.pdf?src-supplier=Element14; ComponentLink5URL: https://datasheet.ciiva.com/7849/1018594-7849869.pdf?src-supplier=Element14; ComponentLink5Description: https://datasheet.ciiva.com/7849/1018594-7849869.pdf?src-supplier=Element14; ComponentLink6URL: https://datasheet.ciiva.com/7983/1018594-7983502.pdf?src-supplier=Element14; ComponentLink6Description: https://datasheet.ciiva.com/7983/1018594-7983502.pdf?src-supplier=Element14; ComponentLink7URL: https://datasheet.ciiva.com/7849/1018594-7849871.pdf?src-supplier=Element14; ComponentLink7Description: https://datasheet.ciiva.com/7849/1018594-7849871.pdf?src-supplier=Element14; Supplier Part Number 1: 311-1.00KLRCT-ND
S1-S5 = Push_Button: Tactile Switch SPST-NO Top Actuated Surface Mount; Value: SWITCH TACTILE SPST-NO 50MA 12V; Digikey Link: https://www.digikey.com/product-detail/en/TL3305AF160QG/EG5350CT-ND/5816195/?itemSeq=304982361; Digikey Part: EG5350CT-ND; Supplier 1: Digi-Key; Supplier Part Number 1: EG5350CT-ND
U1 = TPS65217C: IC PMIC BATT PWR SYST 48VQFN; Manufacturer: Texas Instruments; Manufacturer Part Number: TPS65217CRSLR; Voltage - Supply: 2.75 V ~ 5.8 V; Supplier 1: Digi-Key; Supplier Part Number 1: 296-34814-6-ND; RoHS: RoHS Compliant; Category: Integrated Circuits (ICs); Stock 1: 0; Pricing 1: 1=8.01, 10=7.204, 25=6.5516, 100=4.1918, 250=4.11412, 500=4.0365, 750=3.95888 (USD); Applications: Battery Management, Display (LED Drivers), Handheld/Mobile Devices, Power Supply; Current - Supply: -; Operating Temperature: -40°C ~ 105°C; Mounting Type: Surface Mount; Package / Case: 48-VFQFN Exposed Pad; Supplier Device Package: 48-VQFN-EP (6x6); Packaging: Digi-Reel®; ComponentLink1URL: http://www.ti.com/lit/ds/slvsb64i/slvsb64i.pdf; ComponentLink1Description: Datasheet
U2 = TL5209: LDO Voltage Regulator; Manufacturer: Texas Instruments; Manufacturer Part Number: TL5209DR; Regulator Topology: Positive Adjustable; Voltage - Output: 2.5 V ~ 6.5 V; Voltage - Input: 2.5 V ~ 16 V; Voltage - Dropout (Typical): 0.35V @ 500mA; Number of Regulators: 1; Current - Output: 500mA (Max); Supplier 1: Digi-Key; Supplier Part Number 1: 296-21569-6-ND; RoHS: RoHS Compliant; Category: Integrated Circuits (ICs); Stock 1: 7190; Pricing 1: 1=1.41, 10=1.244, 25=1.1232, 100=0.9828, 250=0.86192, 500=0.7644, 1000=0.6045 (USD); Current - Limit (Min): -; Operating Temperature: -40°C ~ 125°C; Mounting Type: Surface Mount; Package / Case: 8-SOIC (0.154", 3.90mm Width); Supplier Device Package: 8-SOIC; Packaging: Digi-Reel®; ComponentLink1URL: http://media.digikey.com/pdf/Data%20Sheets/Texas%20Instruments%20PDFs/TL5209.pdf; ComponentLink1Description: http://media.digikey.com/pdf/Data%20Sheets/Texas%20Instruments%20PDFs/TL5209.pdf
X1 = 16MHz_Crystal: 16MHz ±30ppm Crystal 18pF 40 Ohms HC-49/US; Value: CRYSTAL 16.0000MHZ 18PF SMD; Digikey Link: https://www.digikey.com/product-detail/en/ABLS-16.000MHZ-B4-T/535-10226-1-ND/2184261/?itemSeq=304982364; Digikey Part: 535-10226-1-ND; Supplier 1: Digi-Key